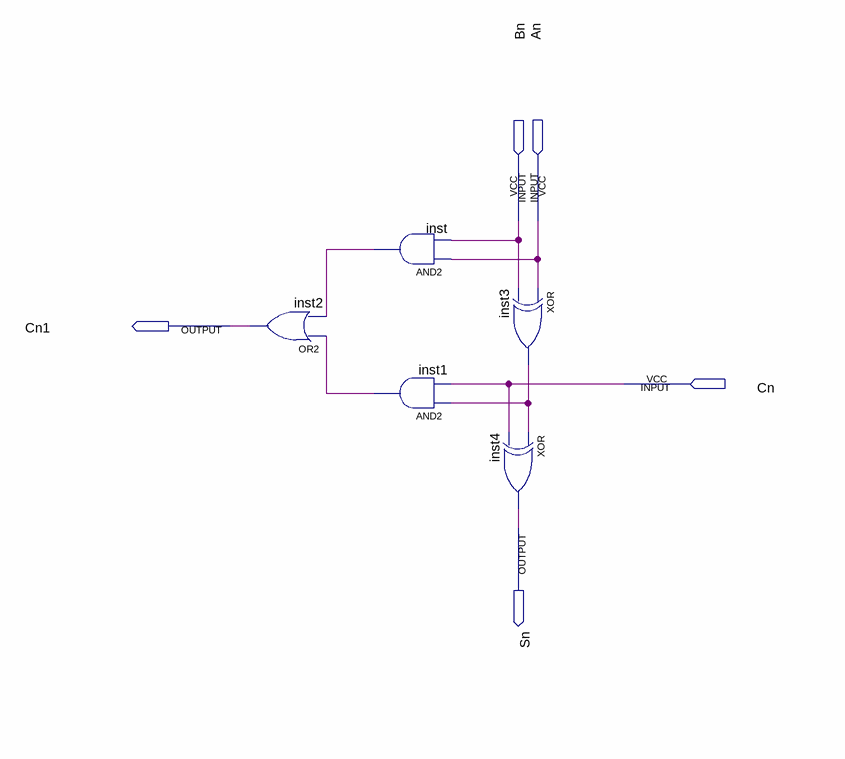
[diagram p0: schematic sheet]
// Quartus schematic Somador_bit.bdf as structural Verilog: 5 symbols, 5 pins
module Somador_bit (
  input  Bn,
  input  An,
  input  Cn,
  output Cn1,
  output Sn
);

  wire inst1_out, inst3_out, inst_out;

  or inst2 (Cn1, inst1_out, inst_out);
  and inst (inst_out, An, Bn);
  and inst1 (inst1_out, inst3_out, Cn);
  xor inst4 (Sn, inst3_out, Cn);
  xor inst3 (inst3_out, An, Bn);
endmodule
